# Altium project ESP32Timecode.PrjPcb
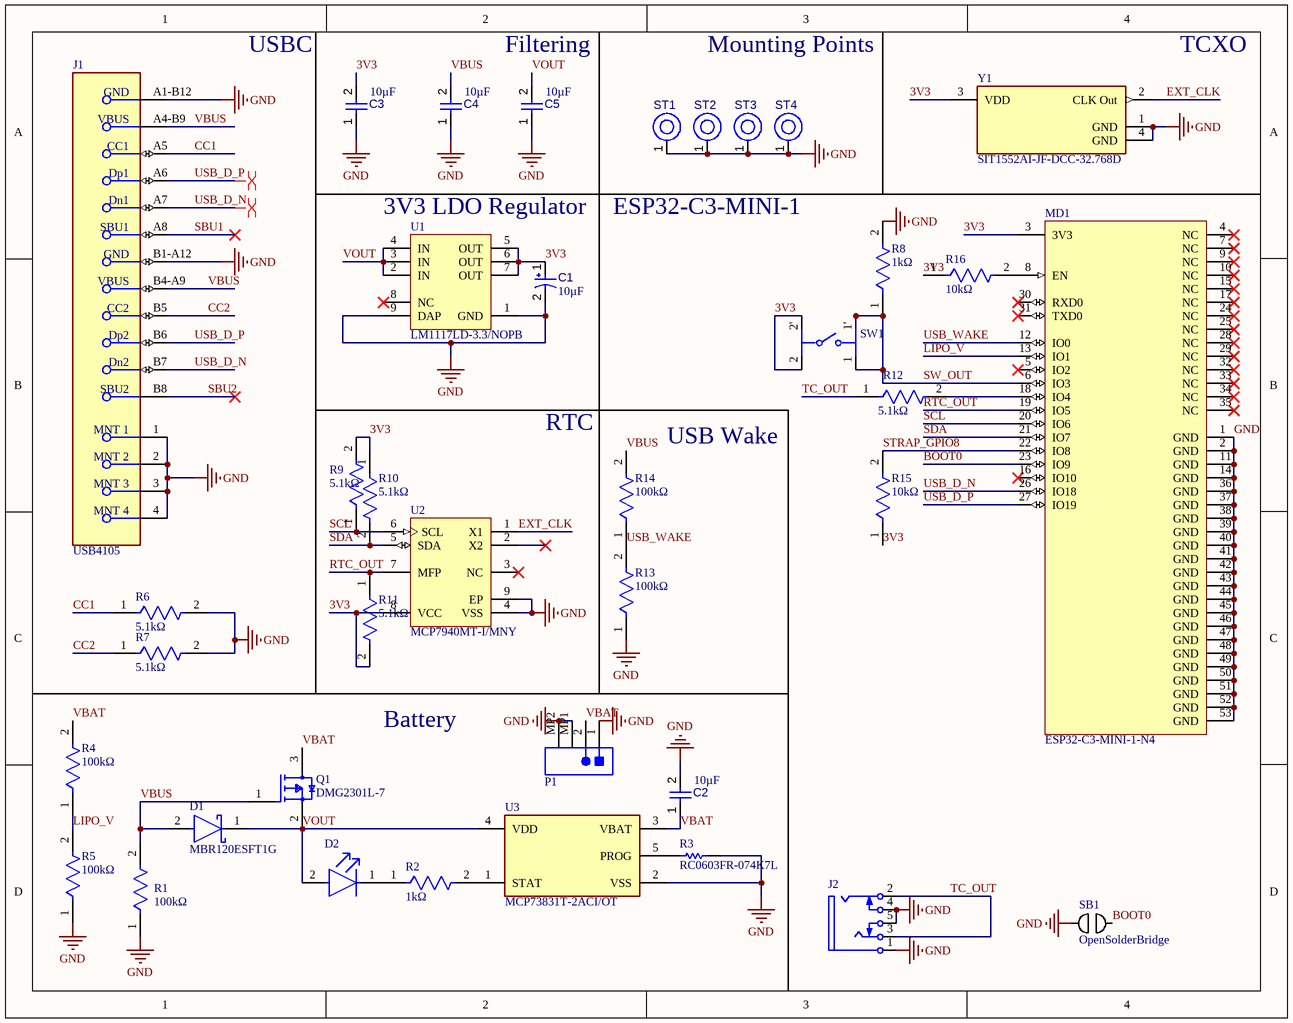
[diagram p0: Sheet1.SchDoc]
1 sheet, 38 parts. Net scope: global (net labels, ports and power ports of the same name join across sheets).
Board file: PCB1.PcbDoc

## Sheet Sheet1.SchDoc
size A; SheetNumber: 1; SheetTotal: 1

### Parts
C1  value 10µF  [CAPMP3529X21-T_V]  (hidden comment: TAJB106M016RNJ)
C2  value 10µF  [CAPC0603(1608)100_L]  (hidden comment: Capacitor 10µF +/-20% 10V 0603)
C3  value 10µF  [CAPC0603(1608)100_L]  (hidden comment: Capacitor 10µF +/-20% 10V 0603)
C4  value 10µF  [CAPC0603(1608)100_L]  (hidden comment: Capacitor 10µF +/-20% 10V 0603)
C5  value 10µF  [CAPC0603(1608)100_L]  (hidden comment: Capacitor 10µF +/-20% 10V 0603)
D1  MBR120ESFT1G  [On_Semiconductor_498_MFG]
D2  VLMO1300-GS08  [FP-6_541-5092_01-4-MFG]  (value not drawn)
J1  USB4105  [FP-USB4105-GF-A-MFG]
J2  35RASMT4BHNTRX  [SWIT-35RASMT4BHNTRX_V]  (value not drawn)
MD1  ESP32-C3-MINI-1-N4  [FP-ESP32-C3-MINI-1-N4-MFG]
P1  S2B-PH-SM4-TB(LF)(SN)  [JST- S2B-PH-SM4-TB(LF)(SN)-2_V]  (value not drawn)
Q1  DMG2301L-7  [FP-SOT23-MFG]
R1  100kΩ  [FP-AC0603-MFG]
R2  1kΩ  [FP-RC0603-0_55-IPC_C]
R3  RC0603FR-074K7L  [RESC1608X55X25LL10T15]
R4  100kΩ  [FP-AC0603-MFG]
R5  100kΩ  [FP-AC0603-MFG]
R6  5.1kΩ  [FP-CRCW0603-e3-IPC_C]
R7  5.1kΩ  [FP-CRCW0603-e3-IPC_C]
R8  1kΩ  [FP-RC0603-0_55-IPC_C]
R9  5.1kΩ  [FP-CRCW0603-e3-IPC_C]
R10  5.1kΩ  [FP-CRCW0603-e3-IPC_C]
R11  5.1kΩ  [FP-CRCW0603-e3-IPC_C]
R12  5.1kΩ  [FP-CRCW0603-e3-IPC_C]
R13  100kΩ  [FP-AC0603-MFG]
R14  100kΩ  [FP-AC0603-MFG]
R15  10kΩ  [FP-RC0603-0_55-IPC_C]
R16  10kΩ  [FP-RC0603-0_55-IPC_C]
SB1  OpenSolderBridge  [OpenSolderBridge-Footprint-1]
ST1  PTH-M2D5X5  [PTH-M2D5X5]  (value not drawn)
ST2  PTH-M2D5X5  [PTH-M2D5X5]  (value not drawn)
ST3  PTH-M2D5X5  [PTH-M2D5X5]  (value not drawn)
ST4  PTH-M2D5X5  [PTH-M2D5X5]  (value not drawn)
SW1  EVQ-9P701P  [FP-EVQ-9P701P-MFG]  (value not drawn)
U1  LM1117LD-3.3/NOPB  [NGN0008A_V]
U2  MCP7940MT-I/MNY  [MCHP-TDFN-MNY8_V]
U3  MCP73831T-2ACI/OT  [FP-C04-091-OT-IPC_B]
Y1  SIT1552AI-JF-DCC-32.768D  [FP-SIT1552AI-JF-DCC-32_76-MFG]

### Nets
GND: C1.2 C2.2 C3.1 C4.1 C5.1 J1.1(MNT_1) J1.2(MNT_2) J1.3(MNT_3) J1.4(MNT_4) J1.A1-B12(GND) J1.B1-A12(GND) J2.1 J2.4 J2.5 MD1.1(GND) MD1.2(GND) MD1.11(GND) MD1.14(GND) MD1.36(GND) MD1.37(GND) MD1.38(GND) MD1.39(GND) MD1.40(GND) MD1.41(GND) MD1.42(GND) MD1.43(GND) MD1.44(GND) MD1.45(GND) MD1.46(GND) MD1.47(GND) MD1.48(GND) MD1.49(GND) MD1.50(GND) MD1.51(GND) MD1.52(GND) MD1.53(GND) P1.1 P1.MP1 P1.MP2 R1.1 R3.2 R5.1 R6.2 R7.2 R8.2 R13.1 SB1.0 ST1.1(H1) ST2.1(H1) ST3.1(H1) ST4.1(H1) U1.1(GND) U1.9(DAP) U2.4(VSS) U2.9(EP) U3.2(VSS) Y1.1(GND) Y1.4(GND)
3V3: C1.1 C3.2 MD1.3(3V3) R9.2 R10.1 R11.2 R15.1 R16.1 SW1.2 SW1.2' U1.5(OUT) U1.6(OUT) U1.7(OUT) U2.8(VCC) Y1.3(VDD)
BOOT0: MD1.23(IO9) SB1.1
CC1: J1.A5(CC1) R6.1
CC2: J1.B5(CC2) R7.1
EXT_CLK: U2.1(X1) Y1.2(CLK_Out)
LIPO_V: MD1.13(IO1) R4.1 R5.2
RTC_OUT: MD1.19(IO5) R11.1 U2.7(MFP)
SBU1: J1.A8(SBU1)
SBU2: J1.B8(SBU2)
SCL: MD1.20(IO6) R9.1 U2.6(SCL)
SDA: MD1.21(IO7) R10.2 U2.5(SDA)
STRAP_GPIO8: MD1.22(IO8) R15.2
SW_OUT: MD1.6(IO3) R8.1 SW1.1 SW1.1'
TC_OUT: J2.2 J2.3 R12.1
USB_D_N: J1.A7(Dn1) J1.B7(Dn2) MD1.26(IO18)
USB_D_P: J1.A6(Dp1) J1.B6(Dp2) MD1.27(IO19)
USB_WAKE: MD1.12(IO0) R13.2 R14.1
VBAT: C2.1 P1.2 Q1.3(D) R4.2 U3.3(VBAT)
VBUS: C4.2 D1.2(A) J1.A4-B9(VBUS) J1.B4-A9(VBUS) Q1.1(G) R1.2 R14.2
VOUT: C5.2 D1.1(C) D2.2(A) Q1.2(S) U1.2(IN) U1.3(IN) U1.4(IN) U3.4(VDD)
NetD2_1: D2.1(C) R2.1
NetMD1_8: MD1.8(EN) R16.2
NetMD1_18: MD1.18(IO4) R12.2
NetR2_2: R2.2 U3.1(STAT)
NetR3_1: R3.1 U3.5(PROG)

Not connected (* = marked no-connect by the designer): MD1 4(NC)* 5(IO2)* 7(NC)* 9(NC)* 10(NC)* 15(NC)* 16(IO10)* 17(NC)* 24(NC)* 25(NC)* 28(NC)* 29(NC)* 30(RXD0)* 31(TXD0)* 32(NC)* 33(NC)* 34(NC)* 35(NC)*; U1 8(NC)*; U2 2(X2)* 3(NC)*

### Layout directives
differential pair: USB_D_N, USB_D_P

### Notes on the sheet
- USBC
- (near C5) Filtering
- Mounting Points
- TCXO
- (near U1) 3V3 LDO Regulator
- ESP32-C3-MINI-1
- RTC
- (near R14) USB Wake
- Battery

### Library data of the parts
C1 = CMP-001-00050-7: Tantalum Capacitor, 10 uF, +/- 20%, 16 V, -55 to 125 degC, 1411 (3528 Metric), RoHS, Tape and Reel; Manufacturer: AVX Corporation; Voltage Rating: 16V; Pins: 2; Min Operating Temperature: -55°C; Package Description: 2-Pin Surface Mount Device, Body 3.5 x 2.85 mm; Package Quantity: 1; Tolerance: 20%; Package Reference: 3528-21; Packaging: TapeandReel; Manufacturer URL: http://www.avx.com/; Datasheet Version: 42736; Mounting Technology: SM; Capacitor Type: Tantalum; Case/Package: 1210; Max Operating Temperature: 125°C; Datasheet URL: http://datasheets.avx.com/TAJ.pdf; RoHS Compliant: True
C2-C5 = CMP-001-00075-4: Chip Capacitor, 10µF +/-20%, 10V, 0603, Thickness 1 mm; Tolerance: 10%; Voltage Rating: 10V; Max Operating Temperature: 85°C; Pins: 2; Case/Package: 0603; Mounting Technology: SMT; Min Operating Temperature: -55°C
D1 = CMP-1055-00434-2: NexarPartId: 330787; Manufacturer Lifecycle Status: ACTIVE; Voltage Rating (DC): 20V; Max Forward Surge Current (Ifsm): 40A; Output Current: 1A; Max Junction Temperature (Tj): 150°C; Polarity: Standard; Peak Reverse Current: 10µA; Element Configuration: Single; Forward Voltage: 530mV; Lifecycle Status: Production; Packaging: Cut Tape; Lead Free: Lead Free; Radiation Hardening: No; Min Operating Temperature: -65°C; Average Rectified Current: 1A; Current Rating: 1A; Max Reverse Voltage (DC): 20V; RoHS: Compliant; REACH SVHC: No SVHC; Max Surge Current: 40A; Length: 2.9mm; Forward Current: 1A; Height: 880µm; Contact Plating: Tin; Width: 1.8mm; Reverse Voltage: 20V; Schedule B: 8541100080; Peak Non-Repetitive Surge Current: 40A; Max Operating Temperature: 150°C; Max Repetitive Reverse Voltage (Vrrm): 20V; Max Reverse Leakage Current: 10µA; Number of Pins: 2; Halogen Free: Halogen Free
D2 = CMP-00030-21709200-1: VLMO1300-GS08 LED Uni-Color Soft Orange 611nm 2-Pin Chip 0603(1608Metric) T/R; Test Current: 20mA; Dominant Wavelength: 605nm; Lens Style: Clear, Rectangular; Reverse Voltage: 5V; Power Dissipation: 75mW; Luminous Intensity: 90mcd; Viewing Angle: 130°; Number of LEDs: 1; Forward Voltage: 2V; Illumination Color: Orange; Ambient Temperature Range High: 85°C; Radiation Hardening: No; Case Code (Metric): 1608; Case Code (Imperial): 0603; Forward Current: 20mA; Number of Pins: 2; Packaging: Cut Tape; Case/Package: 0603; Depth: 800µm; RoHS: Compliant; Schedule B: 8541402000, 8541402000; Length: 1.6mm; Power Rating: 75mW; Mount: Surface Mount; NexarPartId: 21709200; Min Operating Temperature: -35°C; Width: 800µm; REACH SVHC: Unknown; Lead Free: Lead Free; Color: Orange; Wavelength: 605nm; Max Operating Temperature: 85°C; Height: 800µm; Number of Elements: 1
J1 = CMP-245163-000001-1: CONN RCPT USB2.0 TYPEC 5A; Manufacturer Part Number: USB4105-GF-A; Manufacturer: GCT; Voltage Rating: 20V; Is Female: yes; Current Rating: 5/6.25/1.25/0.25A; Number Of Contacts: 16; Conn Orientation: Right Angle; Device Class L1: Connectors; Category: Conn; Lead Free: Yes; RoHS: TRUE; Temperature Range High: +85°C; Digikey Description: CONN RCPT USB2.0 TYPEC 5A; Device Class L3: unset; ComponentLink2Description: Datasheet; Package: 0; Usb Standard: USB 2.0; Device Class L2: USB Connectors; Automotive: No; Temperature Range Low: -40°C; Height: 3.46mm; Temperature: -40°C to +85°C; Contact Material: Gold,Nickel; ComponentLink2URL: https://gct.co/files/drawings/usb4105.pdf; Octopart: https://octopart.com/usb4105-gf-a-gct-106627878
J2 = CMP-002-00007-2: Female 3.5 mm Phone Jack, 5 Position, Height 5 mm, RoHS, Tape and Reel; Manufacturer: Switchcraft; Shielding: Unshielded; Connector Type: Audio; Max Current Rating: 3A; Voltage Rating: 250V; Datasheet Version: Rev. C, 07/2014; Case/Package: 35RASMT4BHNTRX; Gender: Female; Package Description: Female 3.5 mm Phone Jack, 5 Position, Height 5 mm; Max Operating Temperature: 85°C; Colour: Black; Manufacturer URL: http://www.switchcraft.com/; Package Reference: 35RASMT4BHNTRX; Packaging: TapeandReel; Pins: 3; Mounting Technology: SM; Min Operating Temperature: -25°C; Contact Material: Copper; Datasheet URL: http://www.switchcraft.com/Drawings/35rasmt4bhntrx_cd.pdf; Contact Plating: Silver; Current Rating: 3A; RoHS Compliant: True; Package Quantity: 800
MD1 = CMP-10700-116589975-1: Multiprotocol Modules SMD module, ESP32-C3FN4, PCB antenna, -40 C +85 C; Max Frequency: 2.484GHz; Min Supply Voltage: 3V; Current - Transmitting: 350mA; Interface: SPI; Data Rate: 150Mbps; Max Supply Voltage: 3.6V; Number of GPIO: 13; Current - Receiving: 84mA; Min Operating Temperature: -40°C; Height: 2.55mm; Ambient Temperature Range High: 85°C; Max Operating Temperature: 85°C
P1 = CMP-002-00031-2: Male Header, Pitch 2 mm, 1 x 2 Position, Height 5.5 mm, -25 to 85 degC, RoHS, Tape and Reel; Manufacturer: JST; Package Reference: S2B-PH-SM4-TB(LF)(SN)-2; Mounting Technology: SM; Manufacturer URL: http://www.jst.com/home2.html; Package Description: Male Header, Pitch 2 mm, 1 x 2 Position, Height 5.5 mm; Max Operating Temperature: 85°C; Case/Package: S2B-PH-SM4-TB(LF)(SN)-2; Datasheet URL: http://www.jst-mfg.com/product/pdf/eng/ePH.pdf; Connector Type: Header; RoHS Compliant: Unknown; Datasheet Version: Dec-12; Gender: Male; Min Operating Temperature: -25°C
Q1 = CMP-12801-000065-1: MOSFET P-CH 20V 3A SOT23; Manufacturer: Diodes Inc.; Number Of Channels: 1; Turn On Delay Time: 5ns; Drain To Source Resistance: 120mΩ; Max Junction Temp: +150°C; Gate To Source Voltage: 8V; Power Dissipation: 1.5W; Rthja Max: 83°C/W; Max Forward Diode Voltage: -1.2V; Standoff Height: 0.013mm; Threshold Vgs Min: -0.4V; Input Capacitace At Vds: 476pF @ -10V; Depletion Mode: False; Gate Charge At Vgs: 5.5nC @ -4.5V; Pulse Drain Current: -10A; Drain To Source Voltage: -20V; Continuous Drain Current: -3A; Turn Off Delay Time: 30ns; Lead Free: Yes; Package: SOT23; ComponentLink2Description: Datasheet; Device Class L3: MOSFETs; Device Class L1: Discrete Semiconductors; Manufacturer Part Number: DMG2301L-7; Automotive: No; Height: 1.1mm; Category: Trans; Temperature Range High: +150°C; Digikey Description: MOSFET P-CH 20V 3A SOT23; RoHS: TRUE; Number Of P Channels: 1; Footprint Url: https://www.diodes.com/assets/Package-Files/SOT23.pdf; Octopart: https://octopart.com/dmg2301l-7-diodes+inc.-67250456; ComponentLink2URL: https://www.diodes.com/assets/Datasheets/DMG2301L.pdf; Mouser Description: Single P-Channel 20 V 1.5 W 5.5 nC Silicon Surface Mount Mosfet - SOT-23; Drain To Source Breakdown Voltage: -20V; Threshold Vgs Max: -1.2V; Device Class L2: Transistors; Temperature: -55°C to +150°C; Temperature Range Low: -55°C
R1 R4 R5 R13 R14 = CMP-2000-04816-3: RES 100KΩ 1.00% 0.1W 0603; Temperature Coefficient: 100ppm/°C; Voltage Rating: 50V; Max Power Dissipation: 100mW; Tolerance: 1%; Working Voltage: 75V; Resistance: 100kR; Min Operating Temperature: -55°C; Case Code (Imperial): 0603; Width: 0.031inch; Max Operating Temperature: 155°C; Military Standard: Not; Technology: THICK FILM; Ratings: AEC-Q200; Features: Moisture Resistant; Construction: Rectangular; Resistor Type: Thick Film; RoHS Compliant: Yes; Case Code (Metric): 1608; Termination: SMD/SMT; Series: AC; Lead Free: Lead Free; Length: 1.6mm; Depth: 0.8mm; Height: 0.022inch; Power Rating: 100mW; Package Quantity: 1; Packaging: Tape and Reel; Case/Package: 0603; Number of Terminations: 2; Moisture Sensitivity Level: 1
R2 R8 = CMP-1659-00009-5: RES 1K OHM 1% 1/10W 0603; Resistance: 1kR; Voltage Rating: 50V; Power Rating: 100mW; Temperature Coefficient: 100ppm/°C; Military Standard: Not; REACH SVHC: No SVHC; Size Code: 0603; Features: Moisture Resistant; Number of Terminations: 2; Technology: THICK FILM; Series: RC; Case Code (Metric): 1608; Resistance Tolerance: 1%; Resistor Type: Thick Film; Termination: SMD/SMT; Contact Plating: Tin; Radiation Hardening: No; Min Operating Temperature: -55°C; Max Operating Temperature: 155°C; Packaging: Tape and Reel; Max Power Dissipation: 100mW; RoHS Compliant: Yes; Height: 0.45mm; Lead Free: Lead Free; Case/Package: 0603; Length: 1.6mm; Tolerance: 1%; Case Code (Imperial): 0603; Construction: Rectangular; Depth: 0.8mm
R3 = CMP-2000-06942-1: Chip Resistor, 4.7 KOhm, +/- 1%, 0.1 W, -55 to 155 degC, 0603 (1608 Metric), RoHS, Tape and Reel; Manufacturer: Yageo; Power Rating: 100mW; Temperature Coefficient: 100PPM/C; Resistance: 4.7kOhms; Voltage Rating: 50V; Package Reference: 0603; Series: RC; Datasheet Version: Rev. 7, 05/2017; Packaging: Reel; Termination Style: SMD/SMT; Datasheet URL: http://www.yageo.com/documents/recent/PYu-RC_Group_51_RoHS_L_7.pdf; Manufacturer URL: http://www.yageo.com/; Package Description: 2-Pin Surface Mount Device, Body 1.6 x 0.8 mm; Case Code - mm: 1608; Case Code - in: 0603; Mounting Technology: SurfaceMount; Operating Temperature Range: -55Cto+155C; Tolerance: 1%; Product: ThickFilmResistorsGeneralPurpose
R6 R7 R9-R12 = CMP-1012-00590-3: RES Thick Film, 5.1kΩ, 1%, 0.1W, 100ppm/°C, 0603; Power Rating: 100mW; Voltage Rating (DC): 75V; Resistance: 5.1kR; Width: 0.85mm; Depth: 0.85mm; Military Standard: Not; Package Quantity: 5000; Case Code (Metric): 1608; Length: 1.55mm; Weight: 7.1E-05oz; Packaging: Tape and Reel; Temperature Coefficient: 100ppm/°C; Case Code (Imperial): 0603; Lead Free: Lead Free; Radiation Hardening: No; Contact Plating: Tin; Composition: Thick Film; Max Operating Temperature: 155°C; Termination: SMD/SMT; Case/Package: 0603; Min Operating Temperature: -55°C; Tolerance: 1%; Voltage Rating: 75V; Mount: Surface Mount; Height: 0.45mm
R15 R16 = CMP-2100-03664-2: RES 10K OHM 1% 1/10W 0603; Voltage Rating: 75V; Voltage Rating (DC): 50V; Resistance: 10kR; Power Rating: 100mW; Temperature Coefficient: 100ppm/°C; Depth: 0.8mm; Termination: SMD/SMT; Resistor Type: Thick Film; Series: RC; Construction: Rectangular; Features: Moisture Resistant; Packaging: Tape and Reel; Min Operating Temperature: -55°C; Number of Terminations: 2; Lead Pitch: 0.3mm; RoHS Compliant: Yes; Case/Package: 0603; Resistance Tolerance: 1%; Military Standard: Not; Weight: 7.1E-05oz; Number of Pins: 2; Tolerance: 1%; Length: 1.6mm; Case Code (Imperial): 0603; Lead Free: Lead Free; Width: 0.8mm; Max Power Dissipation: 100mW; Height: 0.45mm; Max Operating Temperature: 155°C; Case Code (Metric): 1608; Size Code: 0603
SB1 = CMP-002-00074-1
ST1-ST4 = CMP-00028-00004-2: M2 PTH (2.5mm), 5mm pad; Pins: 1
SW1 = CMP-05618-000010-1: SWITCH TACTILE SPST-NO 0.05A 12V; Manufacturer: Panasonic; Contact Resistance: 500mΩ; Contact Current Rating: 50mA; Operating Force: 1.6N; Electromechanical Life: 100000Cycles; Height: 1.55mm; RoHS: TRUE; Digikey Description: SWITCH TACTILE SPST-NO 0.05A 12V; Automotive: No; Device Class L2: Switches; ComponentLink2URL: https://www3.panasonic.biz/ac/e_download/control/switch/light-touch/catalog/sw_lt_eng_3529s_side.pdf?f_cd=402906&via=ok; Lead Free: Yes; Device Class L3: Tactile Switches; Manufacturer Part Number: EVQ-9P701P; Device Class L1: Electromechanical; Category: Switch; Package: EVQ-9P701P; Mouser Description: Tactile Switches SMD 3.5X2.9MM SID-OP L SHAPED TERM 1.6N; Throw Configuration: SPST-NO; Octopart: https://octopart.com/evq-9p701p-panasonic-58006746; Voltage Rating Dc: 12V; Temperature Range Low: -20°C; ComponentLink2Description: Datasheet; Temperature: -20°C to +70°C; Temperature Range High: +70°C
U1 = CMP-0062-01399-3: 800mA Low-Dropout Linear Regulator, 8-pin LLP, Pb-Free; Manufacturer: Texas Instruments; PackageTopMarking: NS*UZXYTT*1117-33; CompType: LDO IC; PowerWise: N; ComponentLink1URL: http://www.ti.com/general/docs/lit/getliterature.tsp?genericPartNumber=LM1117-N&fileType=pdf; PackageDescription: LLP, Plastic, Dual, 4 x 4 x 0.75mm Body, 8 Lead, 0.8mm Pitch; PackageReference: NGN0008A; PinCount: 8; RoHS: Y; ComponentLink1Description: Datasheet URL
U2 = CMP-0186-00324-1: Low-Cost I2C™ Real-Time Clock / Calendar with SRAM, 400 KHz Communications Speed, 64 Bytes SRAM, -40 to 85 degC, 8-pin TDFN (MNY8), Tape and Reel; Manufacturer: Microchip; ComponentLink2URL: http://ww1.microchip.com/downloads/en/DeviceDoc/22292A.pdf; ComponentLink3Description: Package Specification; Mounting Technology: Surface Mount; PackageVersion: C04-129C; ComponentLink4URL: http://www.microchip.com/MCP7940M; DatasheetVersion: Rev. A; PackageReference: TDFN-MNY8; PartNumber: MCP7940MT-I/MNY; ComponentLink4Description: Product URL; ComponentLink2Description: Datasheet; ComponentLink3URL: http://www.microchip.com/stellent/groups/techpub_sg/documents/packagingspec/en012702.pdf; PackageDescription: 8-Lead Plastic Dual Flat, 2 x 3 mm Body, 0.5 mm Pitch; ComponentLink1Description: Manufacturer URL; ComponentLink1URL: http://www.microchip.com
U3 = CMP-0133-00143-2: IC CONTROLLR LI-ION 4.2V SOT23-5; Max Power Dissipation: 1.54W; Output Current: 500mA; Max Output Voltage: 4.5V; Number of Outputs: 1; Min Output Voltage: 4.168V; Min Supply Voltage: 3.75V; Max Input Voltage: 6V; Voltage Rating: 4.534V; Drain to Source Resistance: 350mR; Max Operating Temperature: 85°C; Length: 0.122inch; Number of Pins: 5; REACH SVHC: No SVHC; Radiation Hardening: No; Min Operating Temperature: -40°C; Weight: 0.00709oz; Contact Plating: Tin; Termination: SMD/SMT; Case/Package: SOT-23; Mount: Surface Mount; Width: 0.071inch; Packaging: Tape and Reel; Number of Cells: 1; Max Charge Current: 500mA; Height: 0.051inch; Number of Channels: 1; Output Voltage: 4.2V; Max Supply Voltage: 6V; Lead Free: Lead Free
Y1 = CMP-25159-262229-1: MEMS OSC TCXO 32.7680KHZ LVCMOS; Frequency: 32.768kHz; Frequency Stability: 10ppm; Min Operating Temperature: -40°C; RoHS Compliant: Yes; Height: 0.024inch; Length: 0.061inch; Width: 0.033inch; Max Operating Temperature: 85°C; Packaging: Tape and Reel; Mount: Surface Mount